# EAGLE design Display (EAGLE 4.03)
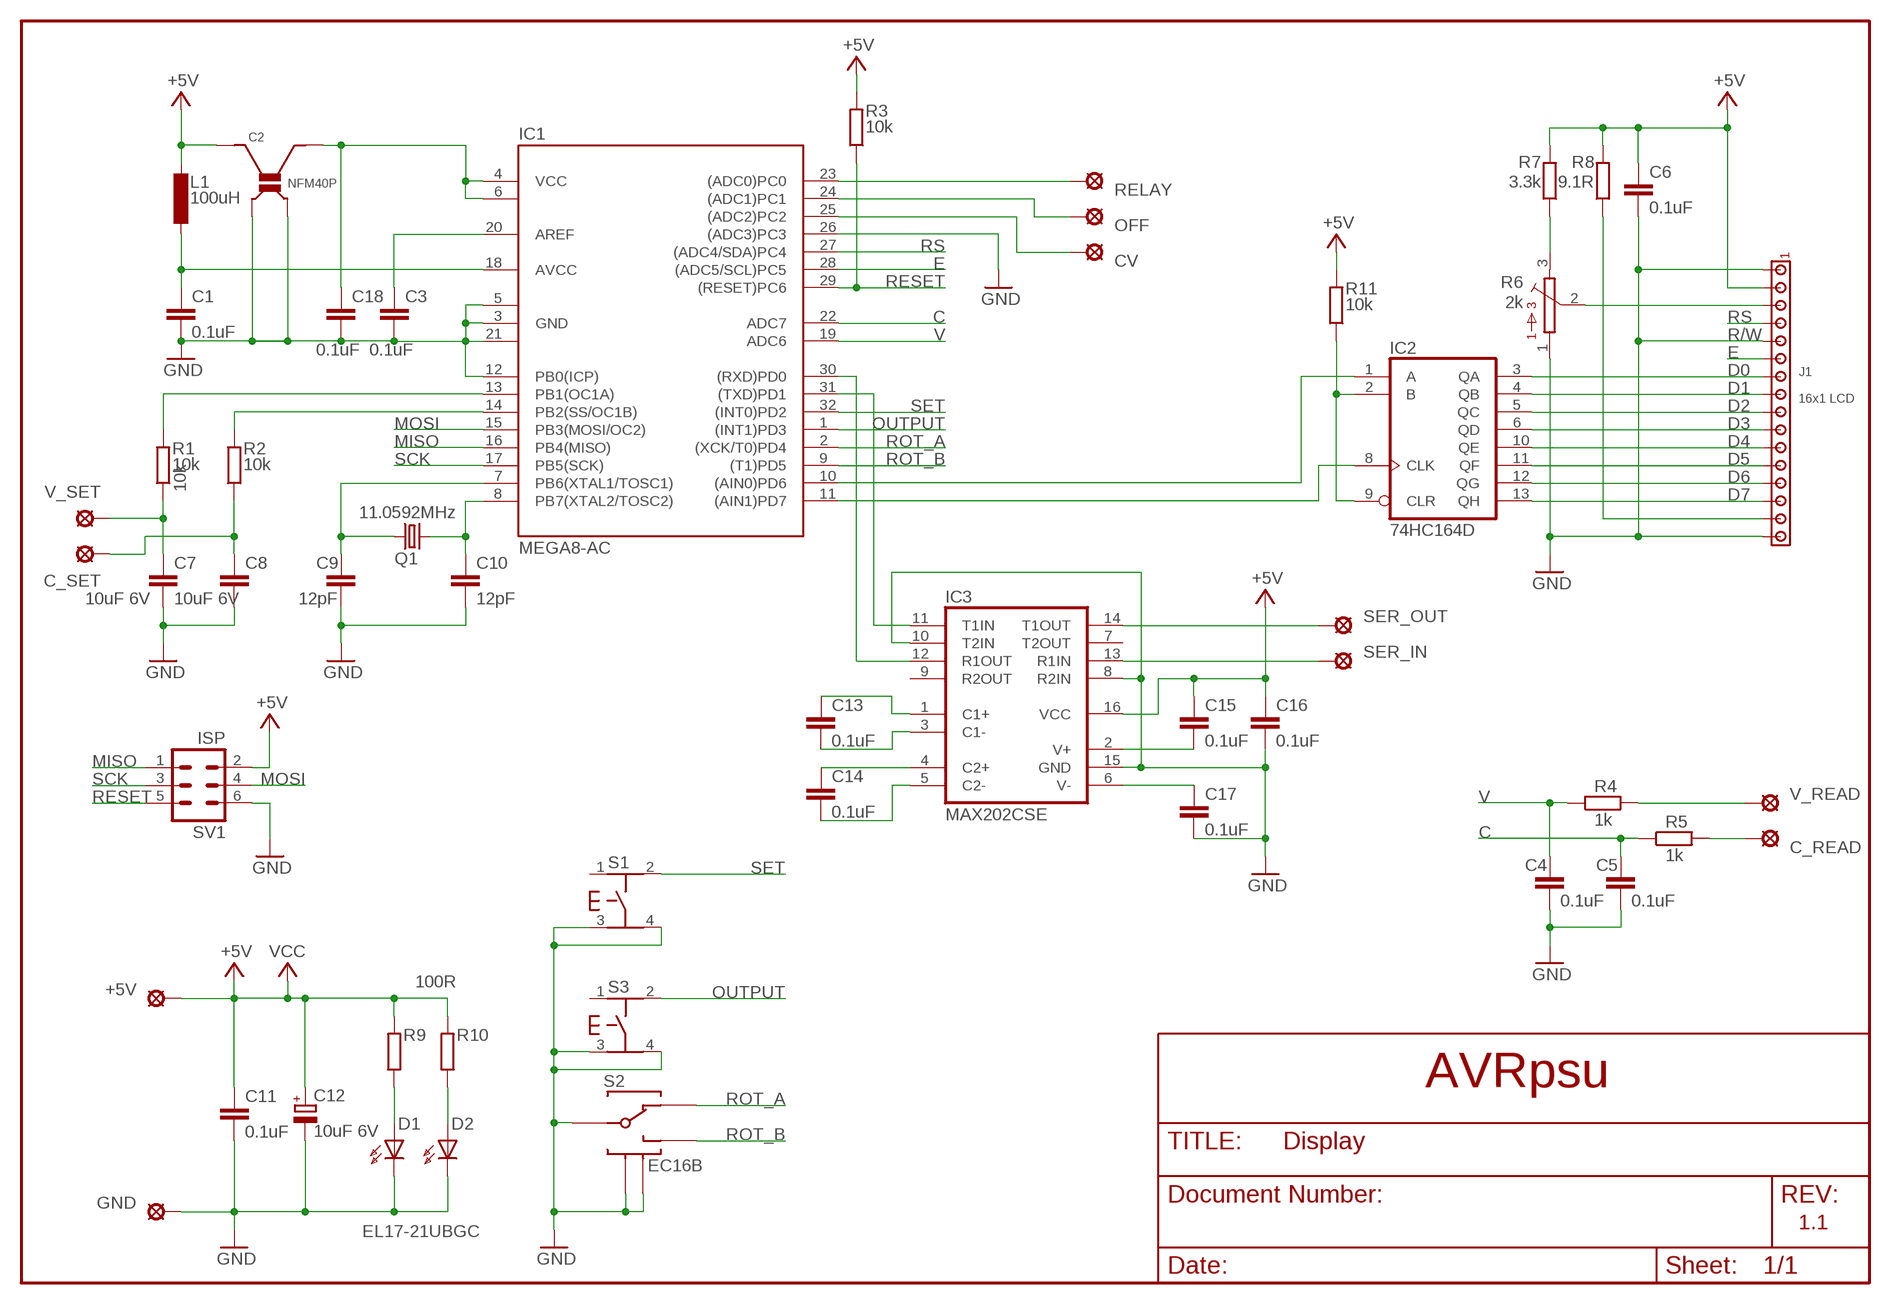
[diagram p0: schematic, sheet 1]

## Parts
+5V  SMD  [SMD]
C1  0.1uF  C-EUC0805  [C0805]
C2  NFM40P  [1206]
C3  0.1uF  C-EUC0805  [C0805]
C4  0.1uF  C-EUC0805  [C0805]
C5  0.1uF  C-EUC0805  [C0805]
C6  0.1uF  C-EUC0805  [C0805]
C7  10uF 6V  C-EUC3216  [C3216]
C8  10uF 6V  C-EUC3216  [C3216]
C9  12pF  C-EUC0805  [C0805]
C10  12pF  C-EUC0805  [C0805]
C11  0.1uF  C-EUC0805  [C0805]
C12  10uF 6V  CPOL-EUCT3216  [CT3216]
C13  0.1uF  C-EUC0805  [C0805]
C14  0.1uF  C-EUC0805  [C0805]
C15  0.1uF  C-EUC0805  [C0805]
C16  0.1uF  C-EUC0805  [C0805]
C17  0.1uF  C-EUC0805  [C0805]
C18  0.1uF  C-EUC0805  [C0805]
C_READ  SMD  [SMD]
C_SET  SMD  [SMD]
CV  SMD  [SMD]
D1  EL17-21UBGC  SMD0805  [0805]
D2  SMD0805  [0805]
GND  SMD  [SMD]
IC1  MEGA8-AC  [TQFP32]
IC2  74HC164D  [SO14]
IC3  MAX202CSE  [SO16]
J1  16x1 LCD  1X16_01  [1X16_254]
L1  100uH  L-EULQH4N  [LQH4N]
OFF  SMD  [SMD]
Q1  11.0592MHz  SM49  [SM49]
R1  10k  R-EU_R0805  [R0805]
R2  10k  R-EU_R0805  [R0805]
R3  10k  R-EU_R0805  [R0805]
R4  1k  R-EU_R0805  [R0805]
R5  1k  R-EU_R0805  [R0805]
R6  2k  23B  [23B]
R7  3.3k  R-EU_R0805  [R0805]
R8  9.1R  R-EU_R0805  [R0805]
R9  100R  R-EU_R0805  [R0805]
R10  R-EU_R0805  [R0805]
R11  10k  R-EU_R0805  [R0805]
RELAY  SMD  [SMD]
S1  HH  [HH]
S2  EC16B  [EC16B]
S3  HH  [HH]
SER_IN  SMD  [SMD]
SER_OUT  SMD  [SMD]
SV1  ISP  MA03-2  [MA03-2]
V_READ  SMD  [SMD]
V_SET  SMD  [SMD]

## Nets
+5V: +5V.P$1(MP) C2.1 C6.2 C11.2 C12.+ C15.2 C16.2 IC3.16(VCC) J1.P$2 L1.P$2 R3.2 R7.2 R8.2 R9.2 R10.2 R11.2 SV1.2 ; supply symbol labelled VCC
AVCC: C1.2 IC1.18(AVCC) L1.P$1
C: C5.2 IC1.22(ADC7) R5.1
C_READ: R4.2 V_READ.P$1(MP)
C_SET: C8.2 C_SET.P$1(MP) R2.1
CV: CV.P$1(MP) IC1.25((ADC2)PC2)
D0: IC2.3(QA) J1.P$7
D1: IC2.4(QB) J1.P$8
D2: IC2.5(QC) J1.P$9
D3: IC2.6(QD) J1.P$10
D4: IC2.10(QE) J1.P$11
D5: IC2.11(QF) J1.P$12
D6: IC2.12(QG) J1.P$13
D7: IC2.13(QH) J1.P$14
E: IC1.28((ADC5/SCL)PC5) J1.P$6
GND: C1.1 C2.2A C2.2B C3.1 C4.1 C5.1 C6.1 C7.1 C8.1 C9.1 C10.1 C11.1 C12.- C16.1 C17.1 C18.1 D1.C D2.C GND.P$1(MP) IC1.3(GND) IC1.5(GND1) IC1.12(PB0(ICP)) IC1.21(GND2) IC1.26((ADC3)PC3) IC3.8(R2IN) IC3.10(T2IN) IC3.15(GND) J1.P$1 J1.P$5 J1.P$16 R6.1 S1.3 S1.4 S2.C S2.FG S2.FG2 S3.3 S3.4 SV1.6
MISO: IC1.16(PB4(MISO)) SV1.1
MOSI: IC1.15(PB3(MOSI/OC2)) SV1.4
N$5: IC2.2(B) IC2.9(CLR) R11.1
N$6: IC1.10((AIN0)PD6) IC2.1(A)
N$7: IC1.11((AIN1)PD7) IC2.8(CLK)
N$8: C13.2 IC3.1(C1+)
N$9: IC1.13(PB1(OC1A)) R1.2
N$10: IC1.14(PB2(SS/OC1B)) R2.2
N$11: C9.2 IC1.7(PB6(XTAL1/TOSC1)) Q1.1
N$12: C10.2 IC1.8(PB7(XTAL2/TOSC2)) Q1.2
N$13: R6.3 R7.1
N$14: J1.P$15 R8.1
N$15: C13.1 IC3.3(C1-)
N$16: C14.2 IC3.4(C2+)
N$17: D2.A R10.1
N$18: C14.1 IC3.5(C2-)
N$19: C2.3 C18.2 IC1.4(VCC) IC1.6(VCC1)
N$20: IC3.14(T1OUT) SER_OUT.P$1(MP)
N$21: C3.2 IC1.20(AREF)
N$22: J1.P$3 R6.2
N$23: IC3.13(R1IN) SER_IN.P$1(MP)
N$29: IC1.31((TXD)PD1) IC3.11(T1IN)
N$30: IC1.30((RXD)PD0) IC3.12(R1OUT)
N$32: D1.A R9.1
OFF: IC1.24((ADC1)PC1) OFF.P$1(MP)
OUTPUT: IC1.1((INT1)PD3) S3.2
RELAY: IC1.23((ADC0)PC0) RELAY.P$1(MP)
RESET: IC1.29((RESET)PC6) R3.1 SV1.5
ROT_A: IC1.2((XCK/T0)PD4) S2.A
ROT_B: IC1.9((T1)PD5) S2.B
RS: IC1.27((ADC4/SDA)PC4) J1.P$4
SCK: IC1.17(PB5(SCK)) SV1.3
SET: IC1.32((INT0)PD2) S1.2
V: C4.2 IC1.19(ADC6) R4.1
V++: C15.1 IC3.2(V+)
V-: C17.2 IC3.6(V-)
V_READ: C_READ.P$1(MP) R5.2
V_SET: C7.2 R1.1 V_SET.P$1(MP)
Unconnected: IC3.7(T2OUT) IC3.9(R2OUT) S1.1 S3.1

## Notes on the sheet
- R/W
- AVRpsu
- 1.1

## Power pins joined to a net without a drawn wire
+5V: IC2.14(VCC)
GND: IC2.7(GND)

## Library data of the parts
+5V C_READ C_SET CV GND OFF RELAY SER_IN SER_OUT V_READ V_SET = solpad:SMD: SOLDER PAD SMD solder pad
C1 C3-C11 C13-C18 = rcl:C-EU: CAPACITOR, European symbol
C2 = murata-filter:NFM40P: EMI-FILTER Chip filter
C12 = rcl:CPOL-EU: POLARIZED CAPACITOR, European symbol
D1 D2 = led:SMD: LED SMD LEDs
IC1 = atmel:MEGA8: MICROCONTROLLER 8KB Flash 512 Bytes EEPROM 1KB RAM 8-channel 10-bit ADC USART 3 PWM channels
IC2 = 74xx-eu:74*164: 8-bit parallel out SHIFT REGISTER
IC3 = maxim:MAX202CSE: RS-232 TRANCEIVER
J1 = con-pads:1X16_01: Pad connectors
L1 = rcl:L-EU: INDUCTOR, European symbol
Q1 = crystal:SM49: CRYSTAL
R1-R5 R7-R11 = rcl:R-EU_: RESISTOR, European symbol
R6 = pot:23B: POTENTIOMETER BI Technologies trimmer
S1 S3 = switch-alps:HH: SWITCH 6x6 mm switch
S2 = rotary-encoder-alps:EC16B: ROTARY ENCODER 24 Pulses/rev
SV1 = con-lstb:MA03-2: PIN HEADER

## Board
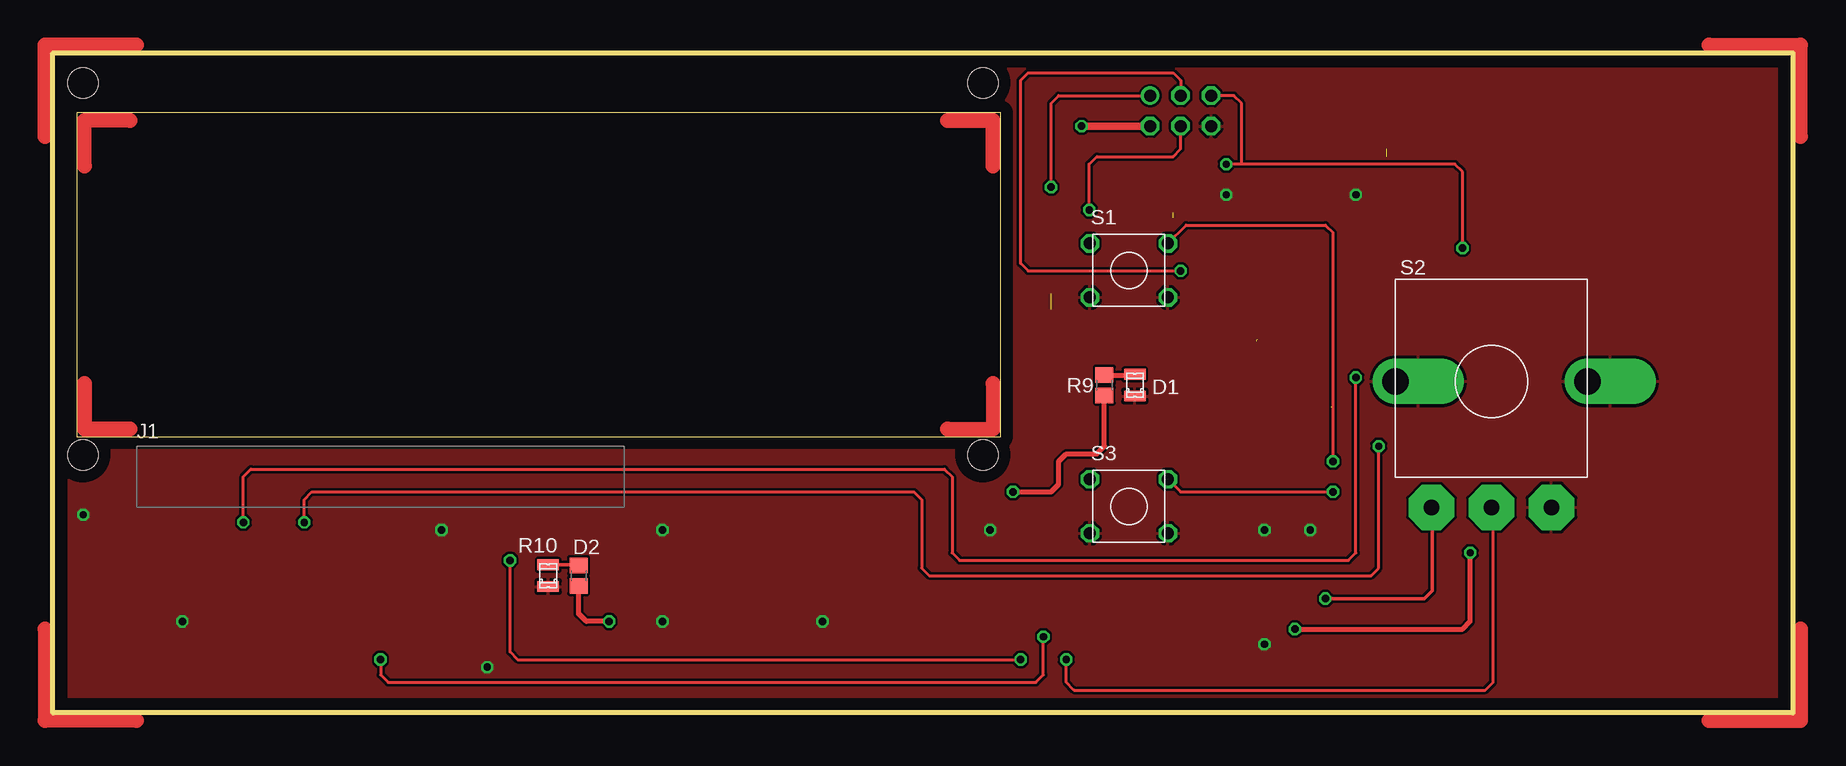
[diagram p1: board, top side]
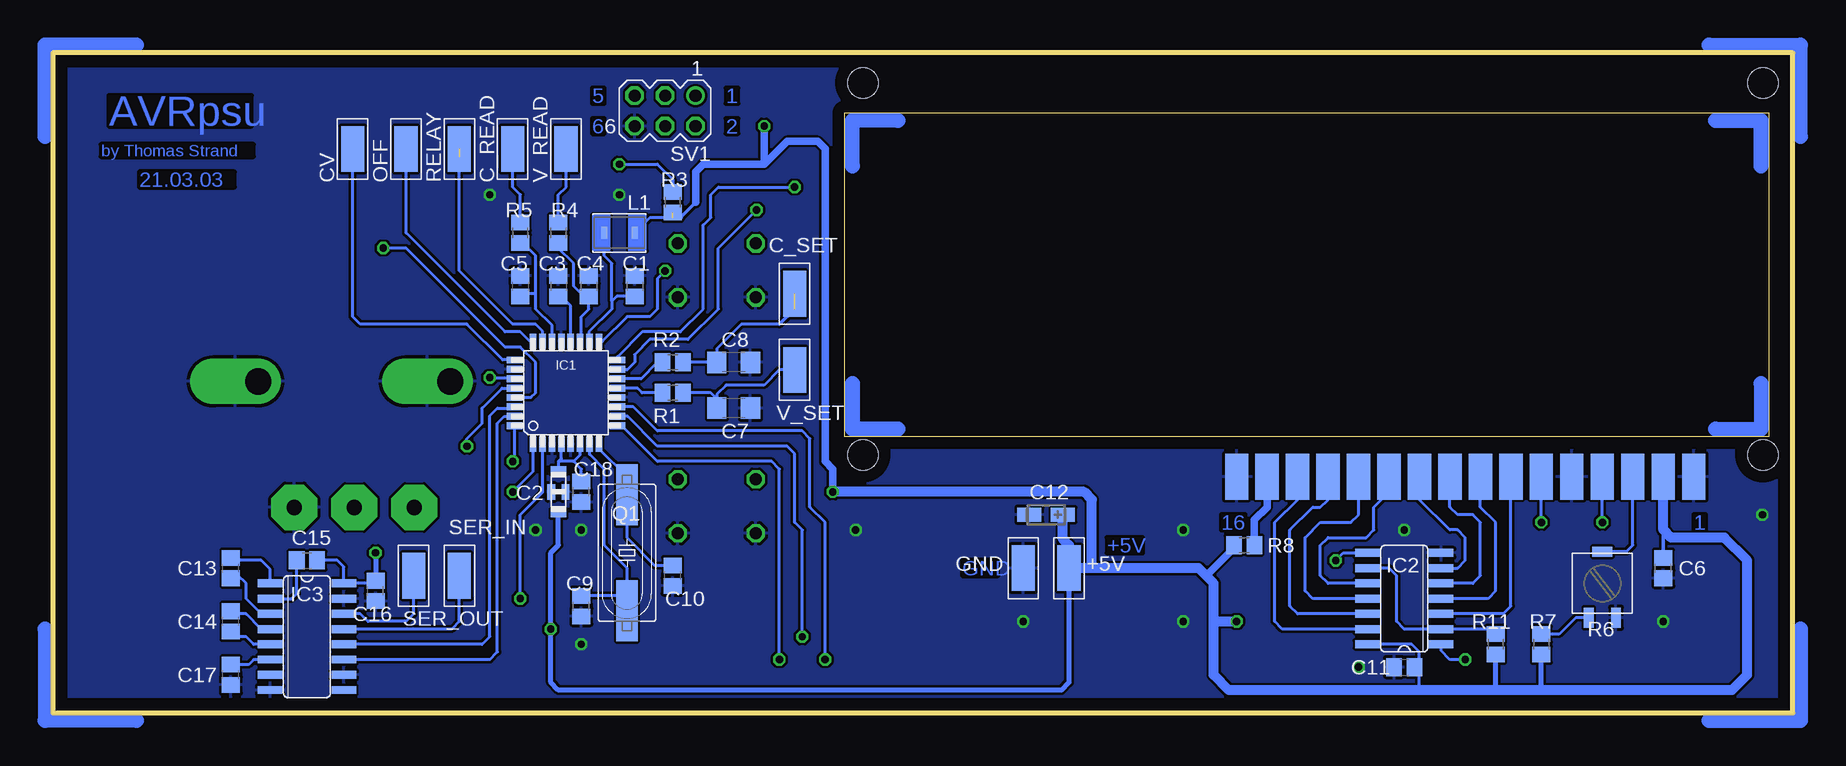
[diagram p2: board, bottom side, seen from below]

Size 145 x 55 mm. Coordinates in mm from the lower left corner, seen from the top.
Outline: 0,0 0,55 145,55 145,0 0,0
Copper layers used: Top, Bottom
Holes 2.54 mm at 2.5,52.5 77.5,52.5 2.5,21.5 77.5,21.5

### Footprints (pad centres in the part's own frame; a part is rotated, then mirrored left to right if it is on the bottom)
SMD = smd 3.81 x 1.93: P$1 0,0
C0805 = smd 1.3 x 1.5: 1 -0.85,0; 2 0.85,0
1206 = smd 1.27 x 0.635: 1 0,1.8; 3 0,-1.8 | smd 0.635 x 1.27: 2A -0.6,0; 2B 0.6,0
C3216 = smd 1.6 x 1.8: 1 -1.4,0; 2 1.4,0
CT3216 = smd 2 x 1.2: + -1.4,0; - 1.4,0
0805 = smd 1.778 x 0.914: A 0,-0.9; C 0,0.9
TQFP32 = smd 1.27 x 0.559: 1 -4.293,2.743; 2 -4.293,1.956; 3 -4.293,1.168; 4 -4.293,0.381; 5 -4.293,-0.381; 6 -4.293,-1.168; 7 -4.293,-1.956; 8 -4.293,-2.743; 17 4.293,-2.743; 18 4.293,-1.956; 19 4.293,-1.168; 20 4.293,-0.381; 21 4.293,0.381; 22 4.293,1.168; 23 4.293,1.956; 24 4.293,2.743 | smd 0.559 x 1.27: 9 -2.743,-4.293; 10 -1.956,-4.293; 11 -1.168,-4.293; 12 -0.381,-4.293; 13 0.381,-4.293; 14 1.168,-4.293; 15 1.956,-4.293; 16 2.743,-4.293; 25 2.743,4.293; 26 1.956,4.293; 27 1.168,4.293; 28 0.381,4.293; 29 -0.381,4.293; 30 -1.168,4.293; 31 -1.956,4.293; 32 -2.743,4.293
SO14 = smd 0.66 x 2.032: 1 -3.81,-3.073; 2 -2.54,-3.073; 3 -1.27,-3.073; 4 0,-3.073; 5 1.27,-3.073; 6 2.54,-3.073; 7 3.81,-3.073; 8 3.81,3.073; 9 2.54,3.073; 10 1.27,3.073; 11 0,3.073; 12 -1.27,3.073; 13 -2.54,3.073; 14 -3.81,3.073
SO16 = smd 0.66 x 2.032: 1 -4.445,-3.073; 2 -3.175,-3.073; 3 -1.905,-3.073; 4 -0.635,-3.073; 5 0.635,-3.073; 6 1.905,-3.073; 7 3.175,-3.073; 8 4.445,-3.073; 9 4.445,3.073; 10 3.175,3.073; 11 1.905,3.073; 12 0.635,3.073; 13 -0.635,3.073; 14 -1.905,3.073; 15 -3.175,3.073; 16 -4.445,3.073
1X16_254 = smd 1.93 x 3.81 bottom: P$1 -19.05,0; P$2 -16.51,0; P$3 -13.97,0; P$4 -11.43,0; P$5 -8.89,0; P$6 -6.35,0; P$7 -3.81,0; P$8 -1.27,0; P$9 1.27,0; P$10 3.81,0; P$11 6.35,0; P$12 8.89,0; P$13 11.43,0; P$14 13.97,0; P$15 16.51,0; P$16 19.05,0
LQH4N = smd 0.508 x 1.016: P$1 -1.27,0; P$2 1.27,0
SM49 = smd 5.08 x 1.778: 1 -4.826,0; 2 4.826,0
R0805 = smd 1.3 x 1.5: 1 -0.85,0; 2 0.85,0
23B = smd 0.813 x 1.676: 1 1.13,-2.87; 3 -1.13,-2.87 | smd 1.676 x 0.813: 2 0,2.64
HH = drill 1.016 octagon: 1 -3.25,2.25; 2 3.25,2.25; 3 -3.25,-2.25; 4 3.25,-2.25
EC16B = drill 1.27 pad 3.81 octagon: A -5,-10.5; B 0,-10.5; C 5,-10.5 | drill 2.184 pad 3.81 offset: FG -8,0; FG2 8,0
MA03-2 = drill 1.016 round: 1 -2.54,-1.27 | drill 1.016 octagon: 2 -2.54,1.27; 3 0,-1.27; 4 0,1.27; 5 2.54,-1.27; 6 2.54,1.27

### Placement (x,y rotation side)
+5V  60.33,12.06 270 bottom
C1  96.52,35.56 270 bottom
C2  102.87,18.41 180 bottom
C3  102.87,35.56 270 bottom
C4  100.33,35.56 270 bottom
C5  106.05,35.56 270 bottom
C6  10.79,12.06 90 bottom
C7  88.27,25.4 180 bottom
C8  88.27,29.21 180 bottom
C9  100.97,8.89 90 bottom
C10  93.34,11.43 90 bottom
C11  32.38,3.81 0 bottom
C12  62.23,16.51 180 bottom
C13  130.18,12.06 90 bottom
C14  130.18,7.62 90 bottom
C15  123.83,12.7 0 bottom
C16  118.11,10.16 90 bottom
C17  130.18,3.17 90 bottom
C18  100.97,18.41 90 bottom
C_READ  106.68,46.99 270 bottom
C_SET  83.19,34.92 90 bottom
CV  120.02,46.99 90 bottom
D1  90.17,27.3 180 top
D2  41.27,11.43 180 top
GND  64.14,12.06 270 bottom
IC1  102.23,26.67 90 bottom
IC2  32.38,9.53 90 bottom
IC3  123.83,6.35 270 bottom
J1  27.3,19.68 0 top
L1  97.79,40.01 0 bottom
OFF  115.57,46.99 90 bottom
Q1  97.16,13.34 90 bottom
R1  93.34,26.67 180 bottom
R2  93.34,29.21 180 bottom
R3  93.34,42.55 270 bottom
R4  102.87,40.01 90 bottom
R5  106.05,40.01 90 bottom
R6  15.88,10.79 0 bottom
R7  20.95,5.71 270 bottom
R8  45.72,13.97 180 bottom
R9  87.63,27.3 270 top
R10  43.81,11.43 270 top
R11  24.77,5.71 270 bottom
RELAY  111.12,46.99 270 bottom
S1  89.67,36.88 0 top
S2  119.88,27.61 0 top
S3  89.67,17.21 0 top
SER_IN  111.12,11.43 90 bottom
SER_OUT  114.94,11.43 90 bottom
SV1  93.98,50.16 180 bottom
U$1  [ANGLE-ARROW-NW1-16]  0,55 0 top
U$2  [ANGLE-ARROW-NW1-16]  145,55 270 top
U$3  [ANGLE-ARROW-NW1-16]  145,0 180 top
U$4  [ANGLE-ARROW-NW1-16]  0,0 90 top
U$5  [ANGLE-SW1-16]  2,23 0 top
U$6  [ANGLE-SW1-16]  2,50 270 top
U$7  [ANGLE-SW1-16]  79,50 180 top
U$8  [ANGLE-SW1-16]  79,23 90 top
V_READ  102.23,46.99 270 bottom
V_SET  83.19,28.57 270 bottom

### Tracks (layer width: path | path; a pad name or v marks a point on that pad's centre or on a via)
+5V  (via drill 0.61)  (1 unrouted)
  Top 0.406: v118.11,13.34 118.11,7.62 117.47,6.99 v103.5,6.99 | R9.2 87.63,22.23 87,21.59 84.45,21.59 83.82,20.95 83.82,19.05 83.19,18.41 v80.01,18.41 | v46.35,7.62 44.45,7.62 43.81,8.26 R10.2
  Top 0.61: v85.72,48.9 SV1.2
  Bottom 0.254: 123.19,12.7 C15.2 121.28,12.7 120.75,12.17 IC3.16 118.11,10.79 | 35.56,5.71 31.75,5.71 31.11,5.08 31.11,3.81 | 31.11,3.81 C11.2 | 31.11,1.91 31.11,3.81 | L1.P$2 95.25,41.27 93.34,41.27
  Bottom 0.305: 91.44,42.55 92.71,41.27 | 10.79,15.24 C6.2
  Bottom 0.406: +5V.P$1 60.33,2.54 60.96,1.91 102.87,1.91 103.5,2.54 v103.5,6.99 103.5,13.34 102.87,13.97 C2.1 | 35.56,5.71 IC2.14 | 24.77,1.91 R11.2 | 92.71,41.27 93.34,41.27 | C16.2 118.11,10.79 v118.11,13.34 | 20.95,1.91 R7.2
  Bottom 0.61: 91.44,42.55 91.44,45.09 90.81,45.72 85.72,45.72 | 85.72,45.72 83.82,47.62 81.28,47.62 80.64,46.99 80.64,20.95 80.01,20.32 v80.01,18.41 | 85.72,45.72 v85.72,48.9 | R8.2 46.57,13.76 48.9,11.43
  Bottom 0.813: 58.42,12.06 49.53,12.06 48.9,11.43 48.26,10.79 48.26,7.62 | 58.42,12.06 +5V.P$1 60.33,13.97 60.83,14.47 C12.+ | 48.26,7.62 48.26,3.17 46.99,1.91 31.11,1.91 24.77,1.91 20.95,1.91 5.08,1.91 3.81,3.17 3.81,12.7 5.71,14.61 10.16,14.61 10.79,15.24 J1.P$2 | v80.01,18.41 59.05,18.41 58.42,17.78 58.42,12.06 | 48.26,7.62 v46.35,7.62
AVCC  (1 unrouted)
  Bottom 0.254: L1.P$1 99.06,38.1 98.42,37.47 98.42,34.29 | 98.42,34.29 98.42,33.66 100.33,31.75 100.33,31.11 | C1.2 98,34.71 98.42,34.29
C
  Bottom 0.254: IC1.22 103.4,32.28 104.78,33.66 104.78,34.92 | R5.1 105.83,39.16 104.78,38.1 104.78,34.92 | C5.2 106.05,34.92 104.78,34.92
C_READ
  Bottom 0.254: R4.2 102.87,43.18 102.23,43.81 V_READ.P$1
C_SET  (1 unrouted)
  Bottom 0.254: C8.2 89.53,29.21 | C8.2 R2.1 | C8.2 89.67,30.35 87.63,32.38 84.45,32.38
  Bottom 0.305: 84.45,32.38 83.19,33.66
CV
  Bottom 0.254: CV.P$1 120.02,33.02 119.38,32.38 110.49,32.38 107.52,29.41 IC1.25
D0
  Bottom 0.254: IC2.3 24.13,8.26 23.5,8.89 J1.P$7
D1
  Bottom 0.254: IC2.4 25.4,9.53 24.77,10.16 24.77,15.88 26.04,17.14 J1.P$8
D2
  Bottom 0.254: IC2.5 26.67,10.79 26.04,11.43 26.04,15.88 26.67,16.51 27.94,16.51 28.57,17.14 J1.P$9
D3
  Bottom 0.254: IC2.6 27.94,12.06 27.3,12.7 27.3,14.61 27.94,15.24 28.57,15.24 31.11,17.78 J1.P$10
D4
  Bottom 0.254: IC2.10 38.73,10.79 39.37,11.43 39.37,13.97 38.73,14.61 35.56,14.61 34.92,15.24 34.92,17.14 33.66,18.41 J1.P$11
D5
  Bottom 0.254: IC2.11 40.01,9.53 40.64,10.16 40.64,14.61 39.37,15.88 36.83,15.88 36.2,16.51 J1.P$12
D6
  Bottom 0.254: IC2.12 41.27,8.26 41.91,8.89 41.91,15.24 40.01,17.14 39.37,17.14 38.73,17.78 J1.P$13
D7
  Bottom 0.254: IC2.13 42.55,6.99 43.18,7.62 43.18,15.88 41.27,17.78 J1.P$14
E  (via drill 0.61)
  Top 0.254: v110.49,22.23 110.49,12.06 109.86,11.43 73.03,11.43 72.39,12.06 72.39,17.78 71.75,18.41 21.59,18.41 20.95,17.78 v20.95,15.88
  Bottom 0.254: v110.49,22.23 110.49,22.86 109.22,24.13 109.22,25.4 107.57,27.05 IC1.28 | v20.95,15.88 J1.P$6
GND  (via drill 0.61)
  other vias: 10.79,7.62 50.8,15.24 100.97,15.24 36.2,3.81 97.79,43.18 78.11,15.24 104.78,15.24 64.14,7.62 100.97,5.71 2.54,16.51 50.8,7.62 108.58,43.18 32.38,15.24
  pour Bottom: 0,55.24 144.78,55.24 144.78,0 0,0
  pour Top: 0,55.24 144.78,55.24 144.78,0 0,0
MISO  (via drill 0.61)
  Top 0.254: v83.19,43.81 83.19,50.8 83.82,51.44 SV1.1
  Bottom 0.254: IC1.16 97.94,29.69 95.89,31.75 92.71,31.75 90.81,33.66 90.81,40.64 90.17,41.27 90.17,43.18 89.53,43.81 v83.19,43.81
MOSI  (via drill 0.61)
  Top 0.254: v86.36,41.91 86.36,45.72 87,46.35 93.34,46.35 93.98,46.99 SV1.4
  Bottom 0.254: v86.36,41.91 89.53,38.73 89.53,33.66 92.08,31.11 95.25,31.11 96.52,29.84 96.52,29.21 97.16,28.57 97.79,28.57 97.84,28.63 IC1.15
N$1  (via drill 0.61)
  other vias: 2.5,21.5
N$2  (via drill 0.61)
  other vias: 2.5,52.5
N$3  (via drill 0.61)
  other vias: 77.5,52.5
N$4  (via drill 0.61)
  other vias: 77.5,21.5
N$5
  Bottom 0.254: IC2.9 33.66,12.06 33.02,11.43 33.02,7.62 32.38,6.99 IC2.2 24.77,6.99 R11.1
N$6  (via drill 0.61)
  Top 0.254: v82.55,6.35 82.55,3.17 81.92,2.54 27.94,2.54 27.3,3.17 v27.3,4.45
  Bottom 0.254: IC1.10 97.1,24.71 94.61,22.23 83.82,22.23 83.19,21.59 83.19,15.88 82.55,15.24 v82.55,6.35 | IC2.1 29.31,5.18 28.57,4.45 v27.3,4.45
N$7  (via drill 0.61)
  Top 0.254: v38.1,12.7 38.1,5.08 38.73,4.45 v80.64,4.45
  Bottom 0.254: IC1.11 96.62,25.5 94.61,23.5 82.55,23.5 81.92,22.86 81.92,17.14 80.64,15.88 v80.64,4.45 | v38.1,12.7 37.47,13.34 IC2.8
N$8
  Bottom 0.254: IC3.1 126.9,11.96 127.64,12.7 130.18,12.7 C13.2
N$9
  Bottom 0.254: IC1.13 96.27,27.05 95.89,26.67 R1.2
N$10
  Bottom 0.254: R2.2 94.61,29.21 95.99,27.84 IC1.14
N$11
  Bottom 0.254: IC1.7 100.28,21.54 99.06,20.32 99.06,13.97 97.16,12.06 97.16,10.16 | 97.16,7.62 Q1.1 97.16,9.53 | 97.16,9.53 97.16,10.16 | 97.16,10.16 97.16,10.79 | C9.2 97.37,9.74 97.16,9.53
N$12
  Bottom 0.254: IC1.8 99.49,22.02 97.16,19.68 Q1.2 97.16,14.61 94.83,12.28 C10.2
N$13
  Bottom 0.254: R7.1 19.47,6.57 18.11,7.92 R6.3
N$14
  Bottom 0.61: R8.1 44.87,16.09 43.81,17.14 J1.P$15
N$15
  Bottom 0.254: IC3.3 127.64,8.26 128.91,9.53 128.91,10.79 129.54,11.43 130.18,11.43 C13.1
N$16
  Bottom 0.254: IC3.4 127.64,6.99 128.91,8.26 130.18,8.26 C14.2
N$17
  Top 0.305: R10.1 43.81,12.06 43.55,12.33 D2.A
N$18
  Bottom 0.254: IC3.5 128.27,5.71 128.91,6.35 130.18,6.35 C14.1
N$19
  Bottom 0.254: 102.87,20.95 C2.3 | IC1.4 102.62,21.21 102.87,20.95 | IC1.6 101.07,21.49 101.6,20.95 | 101.6,20.95 102.87,20.95 | C18.2 100.97,20.32 101.6,20.95
N$20
  Bottom 0.254: IC3.14 119.38,8.26 118.75,7.62 115.57,7.62 114.94,8.26 SER_OUT.P$1
N$21
  Bottom 0.254: IC1.20 101.85,33.91 102.87,34.92 C3.2
N$22
  Bottom 0.254: R6.2 13.87,13.44 13.34,13.97 J1.P$3
N$23
  Bottom 0.254: IC3.13 111.76,6.99 111.12,7.62 SER_IN.P$1
N$29
  Bottom 0.254: IC3.11 108.58,4.45 107.95,5.08 107.95,24.13 107.37,24.71 106.63,24.71 | 106.63,24.71 106.68,24.77 | 106.63,24.71 IC1.31
N$30  (1 unrouted)
  Bottom 0.254: IC3.12 109.22,5.71 108.58,6.35 108.58,24.77 107.95,25.4 106.68,25.4 106.58,25.5
N$32
  Top 0.406: D1.A 90.17,27.94 89.95,28.16 R9.1
OFF
  Bottom 0.254: OFF.P$1 115.57,42.55 115.57,41.91 115.57,40.01 107.31,31.75 106.05,31.75 105.26,30.96 IC1.24
OUTPUT  (via drill 0.61)  (1 unrouted)
  Top 0.254: v106.68,18.41 93.98,18.41 S3.2
  Bottom 0.254: IC1.1 104.98,20.12 v106.68,18.41
RELAY  (1 unrouted)
  Bottom 0.254: IC1.23 104.19,31.8 104.78,32.38 106.68,32.38 111.12,36.83 111.12,46.35
RESET  (via drill 0.61)
  Top 0.254: 99.06,45.72 99.06,50.8 98.42,51.44 SV1.5 | v117.47,38.73 117.47,45.09 116.84,45.72 99.06,45.72 | 99.06,45.72 v97.79,45.72
  Bottom 0.254: IC1.29 105.16,26.29 104.78,26.67 104.78,28.57 | 104.78,28.57 104.78,29.21 106.05,30.48 107.31,30.48 115.57,38.73 v117.47,38.73 | R3.1 93.34,44.45 94.61,45.72 v97.79,45.72 | 104.78,28.57 104.78,28.63
ROT_A  (via drill 0.61)
  Top 0.254: 114.94,17.14 114.91,17.11 S2.A
  Top 0.305: v106.05,9.53 114.3,9.53 114.94,10.16 114.94,17.14
  Bottom 0.254: IC1.2 104.19,18.36 106.05,16.51 v106.05,9.53
ROT_B  (via drill 0.61)
  Top 0.254: v84.45,4.45 84.45,2.54 85.09,1.91 119.38,1.91 120.02,2.54 120.02,17.14 119.98,17.11 S2.B
  Bottom 0.254: v84.45,4.45 84.45,20.32 85.09,20.95 94.61,20.95 97.59,23.93 IC1.9
RS  (via drill 0.61)
  Top 0.254: v108.58,27.94 108.58,13.34 107.95,12.7 75.56,12.7 74.93,13.34 74.93,19.68 74.3,20.32 16.51,20.32 J1.P$4 v15.88,15.88
  Bottom 0.254: IC1.27 106.58,27.84 106.68,27.94 v108.58,27.94 | v15.88,15.88 J1.P$4
SCK  (via drill 0.61)
  Top 0.254: v93.98,36.83 81.28,36.83 80.64,37.47 80.64,52.7 81.28,53.34 93.34,53.34 93.98,52.7 SV1.3
  Bottom 0.254: IC1.17 99.21,30.96 97.16,33.02 95.25,33.02 94.61,33.66 94.61,36.2 v93.98,36.83
SET  (via drill 0.61)
  Top 0.254: S1.2 94.44,40.64 106.05,40.64 106.68,40.01 v106.68,20.95
  Bottom 0.254: 106.53,23.98 IC1.32 106.53,21.11 v106.68,20.95
V
  Bottom 0.254: IC1.19 101.07,31.01 100.97,31.11 100.97,33.02 100.33,33.66 C4.2 100.75,34.71 101.6,35.56 101.6,37.47 102.87,38.73 R4.1
V++
  Bottom 0.254: C15.1 124.67,9.95 125.09,9.53 IC3.2 127,9.53
V-
  Bottom 0.254: C17.2 128.69,4.03 128.27,4.45 IC3.6
V_READ
  Bottom 0.254: R5.2 106.05,43.18 106.68,43.81 C_READ.P$1
V_SET
  Bottom 0.254: R1.1 90.17,26.67 89.53,26.04 89.53,25.4 C7.2 89.67,26.54 88.9,27.3 85.72,27.3 84.45,28.57 V_SET.P$1

### Text on the board
Bottom: 5 | 1 | 6 | AVRpsu | 2 | by Thomas Strand | 21.03.03 | 1 | 16 | +5V | GND
bNames: R6